# Altium schematic sheet main.SchDoc
size A4; SheetNumber: 1; SheetTotal: 1
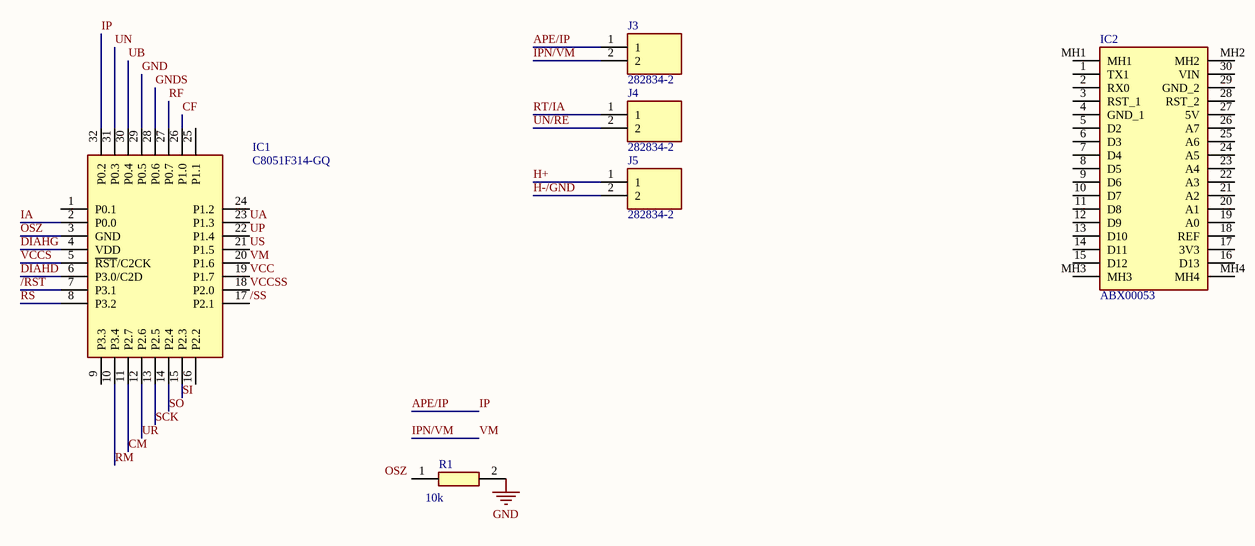
[diagram p0: main.SchDoc]

## Parts
IC1  C8051F314-GQ  [QFP80P900X900X160-32N]
IC2  ABX00053  [ABX00053]
J3  282834-2  [282834-2_1]
J4  282834-2  [282834-2_1]
J5  282834-2  [282834-2_1]
R1  10k  [RESAD1520W63L600D230]

## Nets
GND: IC1.29(P0.5) R1.2
/RST: IC1.7(P3.1)
/SS: IC1.17(P2.1)
APE/IP: IC1.32(P0.2) J3.1  [also labelled IP]
CF: IC1.26(P1.0)
CM: IC1.11(P2.7)
DIAHD: IC1.6(P3.0/C2D)
DIAHG: IC1.4(VDD)
GNDS: IC1.28(P0.6)
H+: J5.1
H-/GND: J5.2
IA: IC1.2(P0.0)
IPN/VM: IC1.20(P1.6) J3.2  [also labelled VM]
OSZ: IC1.3(GND)
RF: IC1.27(P0.7)
RM: IC1.10(P3.4)
RS: IC1.8(P3.2)
RT/IA: J4.1
SCK: IC1.13(P2.5)
SI: IC1.15(P2.3)
SO: IC1.14(P2.4)
UA: IC1.23(P1.3)
UB: IC1.30(P0.4)
UN: IC1.31(P0.3)
UN/RE: J4.2
UP: IC1.22(P1.4)
UR: IC1.12(P2.6)
US: IC1.21(P1.5)
VCC: IC1.19(P1.7)
VCCS: IC1.5(~{RST}/C2CK)
VCCSS: IC1.18(P2.0)

Not connected (* = marked no-connect by the designer): IC1 1(P0.1) 9(P3.3) 16(P2.2) 24(P1.2) 25(P1.1); IC2 1(TX1) 2(RX0) 3(RST_1) 4(GND_1) 5(D2) 6(D3) 7(D4) 8(D5) 9(D6) 10(D7) 11(D8) 12(D9) 13(D10) 14(D11) 15(D12) 16(D13) 17(3V3) 18(REF) 19(A0) 20(A1) 21(A2) 22(A3) 23(A4) 24(A5) 25(A6) 26(A7) 27(5V) 28(RST_2) 29(GND_2) 30(VIN) MH1 MH2 MH3 MH4; R1 1

## Notes on the sheet
- Labels drawn without touching a wire or pin: OSZ

## Library data of the parts
IC1 = C8051F314-GQ: Integrated Circuit; Manufacturer_Name: Silicon Labs; Datasheet Link: https://www.silabs.com/documents/public/data-sheets/C8051F31x.pdf; Height: 1.6mm; Manufacturer_Part_Number: C8051F314-GQ; Mouser Part Number: 634-C8051F314-GQ; Mouser Price/Stock: https://www.mouser.co.uk/ProductDetail/Silicon-Labs/C8051F314-GQ?qs=vyiwtxxqSmTKpdLyYs0rcg%3D%3D; Arrow Part Number: C8051F314-GQ; Arrow Price/Stock: https://www.arrow.com/en/products/c8051f314-gq/silicon-labs?utm_currency=USD&region=europe
IC2 = ABX00053: Integrated Circuit; Manufacturer_Name: Arduino; Datasheet Link: https://content.arduino.cc/assets/ABX00053-datasheet.pdf; Height: 3.25mm; Manufacturer_Part_Number: ABX00053; Mouser Part Number: 782-ABX00053; Mouser Price/Stock: https://www.mouser.co.uk/ProductDetail/Arduino/ABX00053?qs=iLbezkQI%252Bsj092HEuR%252Bsvg%3D%3D; Arrow Part Number: ABX00053; Arrow Price/Stock: https://www.arrow.com/en/products/abx00053/arduino-corporation?utm_currency=USD&region=nac
J3-J5 = 282834-2: Connector; Manufacturer_Name: TE Connectivity; Datasheet Link: https://www.te.com/commerce/DocumentDelivery/DDEController?Action=srchrtrv&DocNm=1-1773458-1_EURO_STYLE_QRG&DocType=Data%20Sheet&DocLang=English&PartCntxt=282834-2&DocFormat=pdf; Manufacturer_Part_Number: 282834-2; Mouser Part Number: 571-282834-2; Mouser Price/Stock: https://www.mouser.co.uk/ProductDetail/TE-Connectivity/282834-2?qs=A%252Bip%252BNCYi6N8cVKuk8xDog%3D%3D; Arrow Part Number: 282834-2; Arrow Price/Stock: https://www.arrow.com/en/products/282834-2/te-connectivity?utm_currency=USD&region=europe
R1 = CF14JT1K00: Resistor; Manufacturer_Name: Stackpole Electronics; Datasheet Link: https://cs.seielect.com/catalog/SEI-CF_CFM.pdf; Manufacturer_Part_Number: CF14JT1K00; Mouser Part Number: 708-CF14JT1K00; Mouser Price/Stock: https://www.mouser.co.uk/ProductDetail/SEI-Stackpole/CF14JT1K00?qs=FESYatJ8odLLAkjsom%2FJYQ%3D%3D; Arrow Part Number: CF14JT1K00; Arrow Price/Stock: https://www.arrow.com/en/products/cf14jt1k00/stackpole-electronics?region=nac